# EAGLE design kirschmann-adsr (EAGLE 7.7.0)
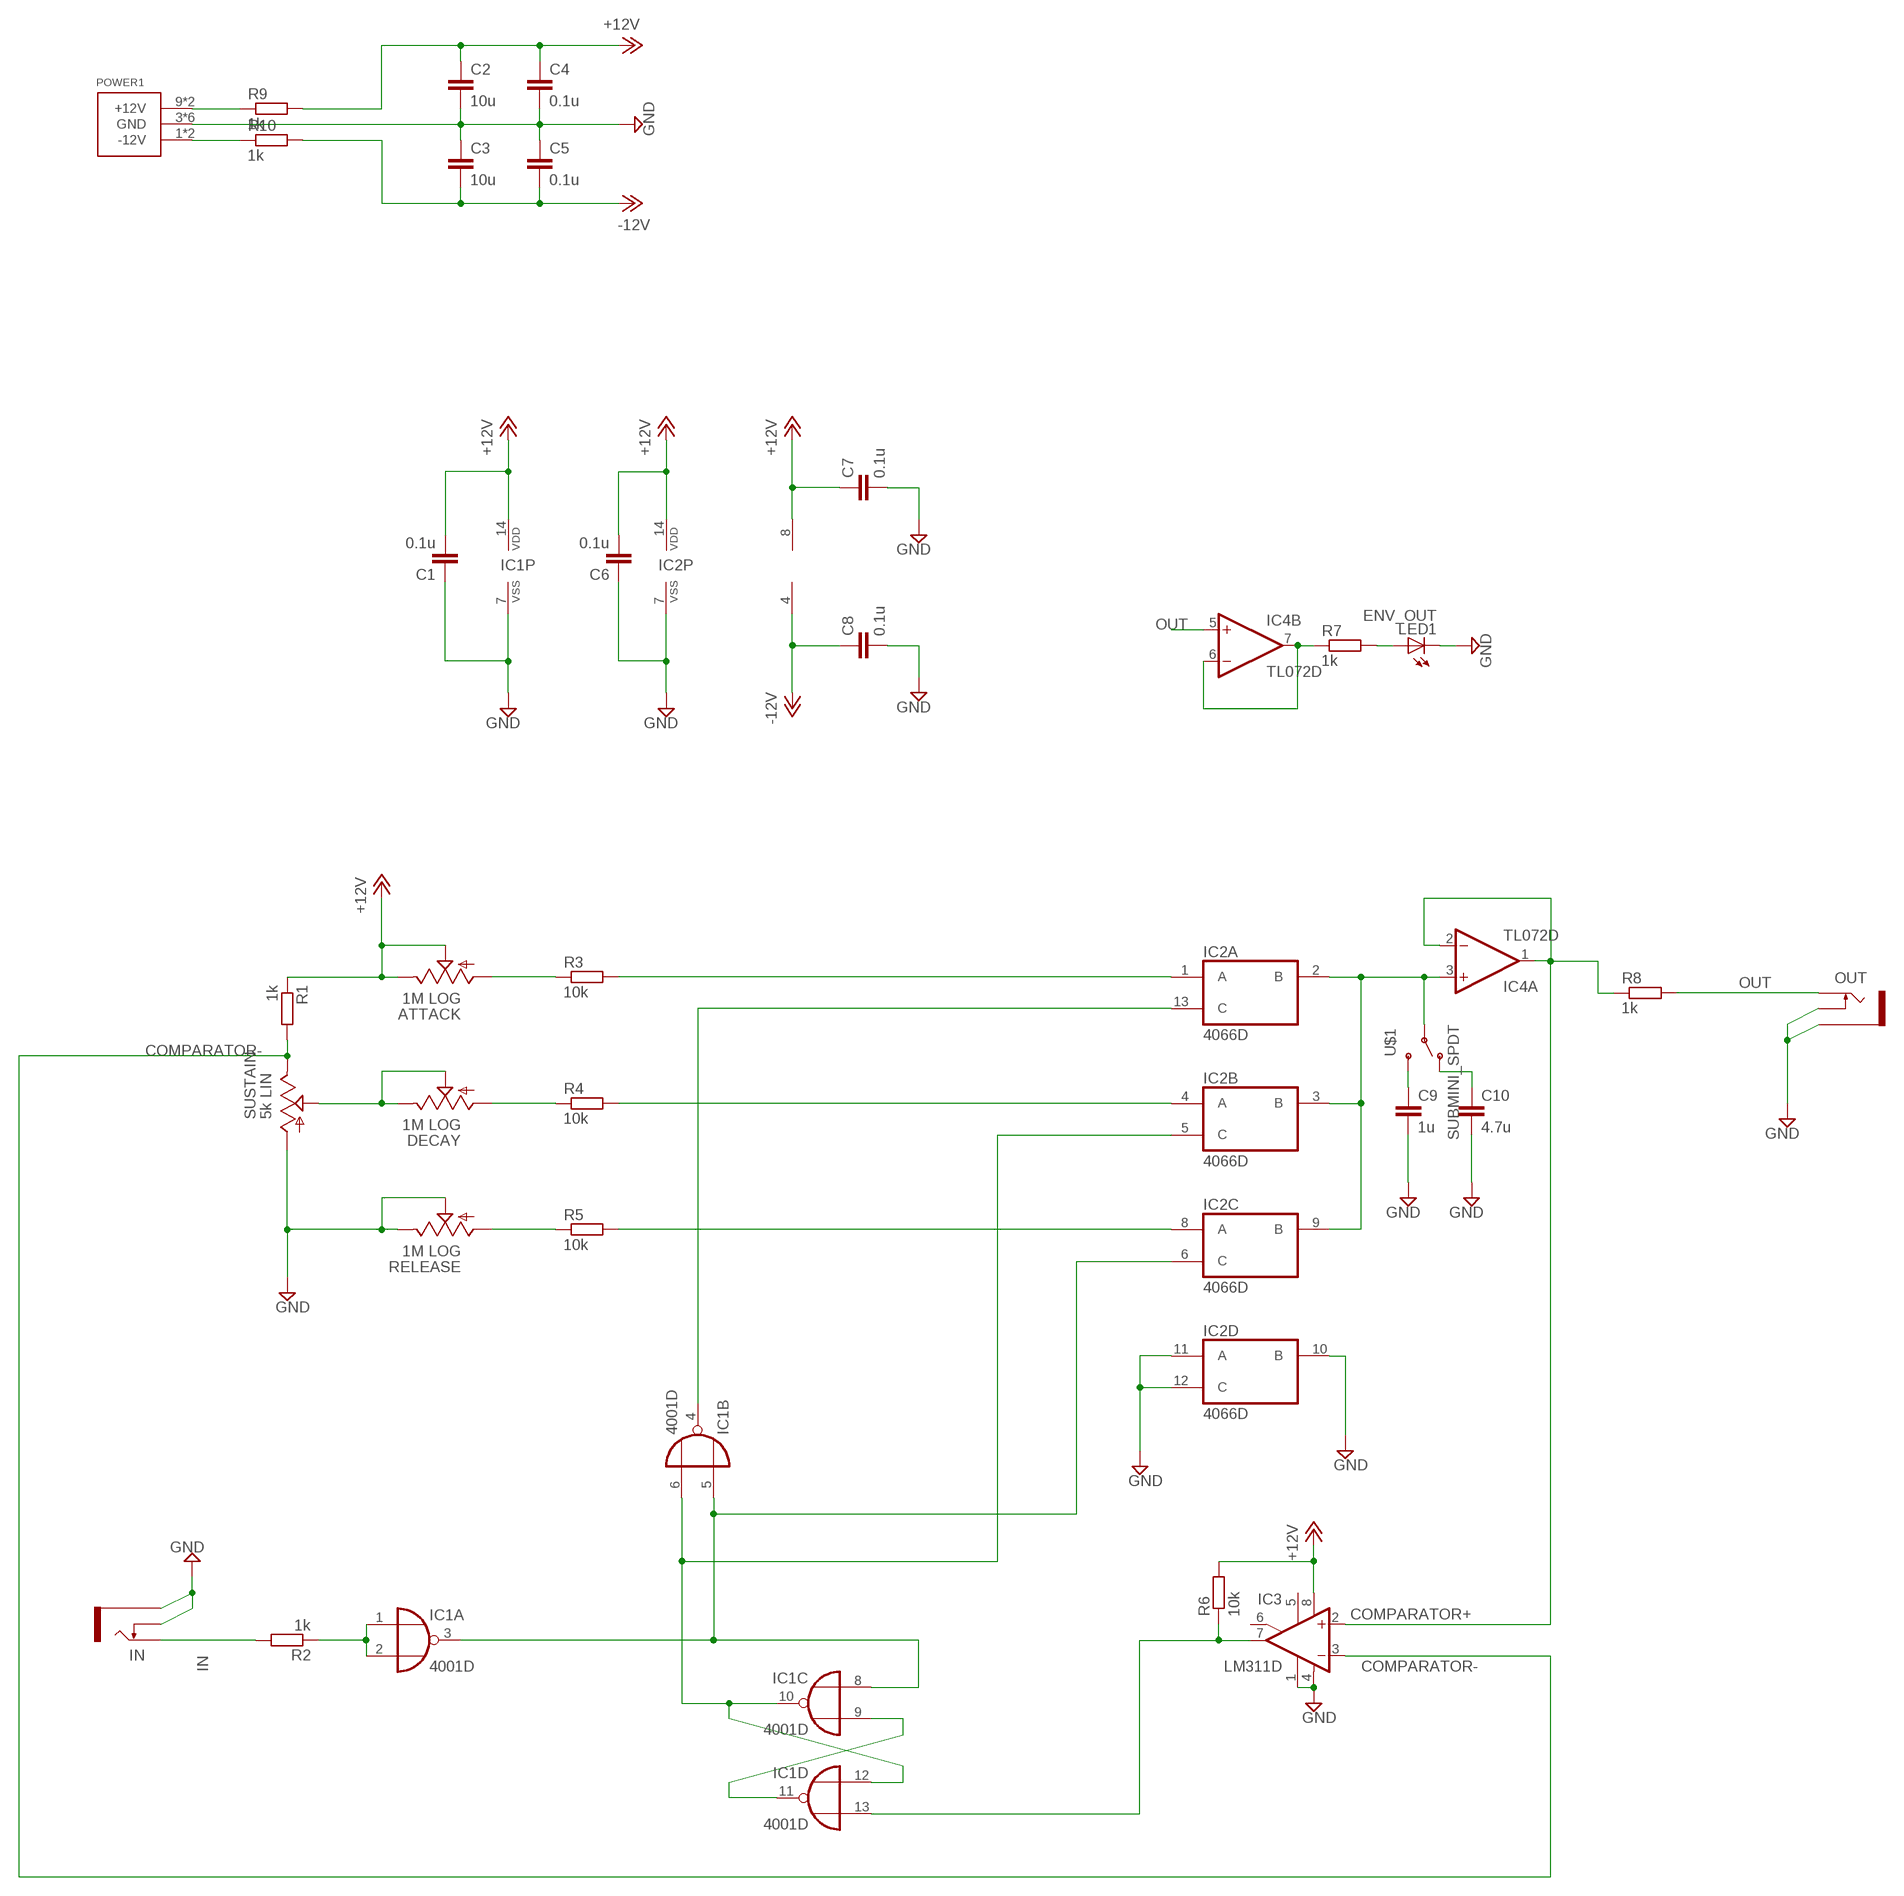
[diagram p0: schematic, sheet 1]

## Parts
ATTACK  1M LOG  9MM_SNAP-IN_POT_  [9MM_SNAP-IN_POT]
C1  0.1u  C-EUC0805  [C0805]
C2  10u  C-EUC0805  [C0805]
C3  10u  C-EUC0805  [C0805]
C4  0.1u  C-EUC0805  [C0805]
C5  0.1u  C-EUC0805  [C0805]
C6  0.1u  C-EUC0805  [C0805]
C7  0.1u  C-EUC0805  [C0805]
C8  0.1u  C-EUC0805  [C0805]
C9  1u  C-EUC0805  [C0805]
C10  4.7u  C-EUC0805  [C0805]
DECAY  1M LOG  9MM_SNAP-IN_POT_  [9MM_SNAP-IN_POT]
IC1  4001D  [SO14]
IC2  4066D  [SO14]
IC3  LM311D  [SO08]
IC4  TL072D  [SO08]
IN  THONKICONNNEW  [WQP-PJ301M-12_JACK]
LED1  ENV_OUT  LED3MM  [LED3MM]
OUT  THONKICONNNEW  [WQP-PJ301M-12_JACK]
POWER1  POWER_SIMPLE10  [POWER_10]
R1  1k  R-EU_R0805  [R0805]
R2  1k  R-EU_R0805  [R0805]
R3  10k  R-EU_R0805  [R0805]
R4  10k  R-EU_R0805  [R0805]
R5  10k  R-EU_R0805  [R0805]
R6  10k  R-EU_R0805  [R0805]
R7  1k  R-EU_R0805  [R0805]
R8  1k  R-EU_R0805  [R0805]
R9  1k  R-EU_R0805  [R0805]
R10  1k  R-EU_R0805  [R0805]
RELEASE  1M LOG  9MM_SNAP-IN_POT_  [9MM_SNAP-IN_POT]
SUSTAIN  5k LIN  9MM_SNAP-IN_POT_  [9MM_SNAP-IN_POT]
U$1  SUBMINI_SPDT  [SUBMINI_TOGGLE]

## Nets
+12V: ATTACK.2(S) ATTACK.3(E) C1.2 C2.1 C4.1 C6.2 C7.1 IC1.14(P:VDD) IC2.14(P:VDD) IC3.8(V+) IC4.8(P:V+) R1.1 R6.2 R9.2
-12V: C3.2 C5.2 C8.1 IC4.4(P:V-) R10.2
COMPARATOR+: IC3.2(+IN) IC4.1(A:OUT) IC4.2(A:-IN) R8.1
COMPARATOR-: IC3.3(-IN) R1.2 SUSTAIN.3(E)
GND: C1.1 C2.2 C3.1 C4.2 C5.1 C6.1 C7.2 C8.2 C9.2 C10.2 IC1.7(P:VSS) IC2.7(P:VSS) IC2.10(D:B) IC2.11(D:A) IC2.12(D:C) IC3.1(GND) IC3.4(V-) IN.P$2_SWITCH(SWITCH) IN.P$3_SLEEVE(SLEEVE) LED1.K(C) OUT.P$2_SWITCH(SWITCH) OUT.P$3_SLEEVE(SLEEVE) POWER1.3(GND) POWER1.4(GND) POWER1.5(GND) POWER1.6(GND) POWER1.7(GND) POWER1.8(GND) RELEASE.2(S) RELEASE.3(E) SUSTAIN.1(A)
IN: IN.P$1_TIP(TIP) R2.2
N$1: IC1.6(B:I1) IC1.10(C:O) IC1.12(D:I0) IC2.5(B:C)
N$2: IC1.9(C:I1) IC1.11(D:O)
N$3: IC2.8(C:A) R5.2
N$4: C9.1 U$1.3(S)
N$5: IC1.13(D:I1) IC3.7(OUT) R6.1
N$6: DECAY.1(A) R4.1
N$7: R5.1 RELEASE.1(A)
N$8: IC1.3(A:O) IC1.5(B:I0) IC1.8(C:I0) IC2.6(C:C)
N$9: IC1.4(B:O) IC2.13(A:C)
N$10: IC2.2(A:B) IC2.3(B:B) IC2.9(C:B) IC4.3(A:+IN) U$1.COM(COMMON)
N$11: C10.1 U$1.1(O)
N$12: IC1.1(A:I0) IC1.2(A:I1) R2.1
N$13: IC2.4(B:A) R4.2
N$14: IC2.1(A:A) R3.2
N$15: IC4.6(B:-IN) IC4.7(B:OUT) R7.1
N$16: LED1.A R7.2
N$17: DECAY.2(S) DECAY.3(E) SUSTAIN.2(S)
N$18: POWER1.9(+12V) POWER1.10(+12V) R9.1
N$19: ATTACK.1(A) R3.1
N$20: POWER1.1(-12V) POWER1.2(-12V) R10.1
OUT: IC4.5(B:+IN) OUT.P$1_TIP(TIP) R8.2
Unconnected: IC3.5(ON) IC3.6(ON/STR)

## Library data of the parts
ATTACK DECAY RELEASE SUSTAIN = MusicThingModular:9MM_SNAP-IN_POT: 9mm vertical snap-in pot, Alpha / Panasonic style
C1-C10 = rcl:C-EU: CAPACITOR, European symbol
IC1 = 40xx:4001: Quad 2-input NOR
IC2 = 40xx:4066: Quad bilateral ANALOG SWITCH
IC3 = linear:LM311: COMPARATOR
IC4 = linear:TL072: OP AMP
IN OUT = MusicThingModular:THONKICONN: 3.5mm socket for Eurorack modular synths
LED1 = led:LED: LED OSRAM: - CHIPLED LG R971, LG N971, LY N971, LG Q971, LY Q971, LO R971, LY R971 LH N974, LH R974 LS Q976, LO Q976, LY Q976 LO Q996 - Hyper CHIPLED LW Q18S LB Q993, LB Q99A, LB R99A - SideLED LS A670, LO A670, LY A670, LG A670, LP A670 LB A673, LV A673, LT A673, LW A673 LH A674 LY A675 LS A676, LA A676, LO A676, LY A676, LW A676 LS A679, LY A679, LG A679 - Hyper Micro SIDELED® LS Y876, LA Y876, LO Y876, LY Y876 LT Y87S - SmartLED LW L88C, LW L88S LB L89C, LB L89S, LG L890 LS L89K, LO L89K, LY L89K LS L896, LA L896, LO L896, LY L896 - TOPLED LS T670, LO T670, LY T670, LG T670, LP T670 LSG T670, LSP T670, LSY T670, LOP T670, LYG T670 LG T671, LOG T671, LSG T671 LB T673, LV T673, LT T673, LW T673 LH T674 LS T676, LA T676, LO T676, LY T676, LB T676, LH T676, LSB T676, LW T676 LB T67C, LV T67C, LT T67C, LS T67K, LO T67K, LY T67K, LW E67C LS E67B, LA E67B, LO E67B, LY E67B, LB E67C, LV E67C, LT E67C LW T67C LS T679, LY T679, LG T679 LS T770, LO T770, LY T770, LG T770, LP T770 LB T773, LV T773, LT T773, LW T773 LH T774 LS E675, LA E675, LY E675, LS T675 LS T776, LA T776, LO T776, LY T776, LB T776 LHGB T686 LT T68C, LB T68C - Hyper Mini TOPLED® LB M676 - Mini TOPLED Santana® LG M470 LS M47K, LO M47K, LY M47K Source: http://www.osram.convergy.de LUXEON: - LUMILED® LXK2-PW12-R00, LXK2-PW12-S00, LXK2-PW14-U00, LXK2-PW14-V00 LXK2-PM12-R00, LXK2-PM12-S00, LXK2-PM14-U00 LXK2-PE12-Q00, LXK2-PE12-R00, LXK2-PE12-S00, LXK2-PE14-T00, LXK2-PE14-U00 LXK2-PB12-K00, LXK2-PB12-L00, LXK2-PB12-M00, LXK2-PB14-N00, LXK2-PB14-P00, LXK2-PB14-Q00 LXK2-PR12-L00, LXK2-PR12-M00, LXK2-PR14-Q00, LXK2-PR14-R00 LXK2-PD12-Q00, LXK2-PD12-R00, LXK2-PD12-S00 LXK2-PH12-R00, LXK2-PH12-S00 LXK2-PL12-P00, LXK2-PL12-Q00, LXK2-PL12-R00 Source: www.luxeon.com KINGBRIGHT: KA-3528ASYC Source: www.kingbright.com
POWER1 = eurorack:POWER_SIMPLE
R1-R10 = rcl:R-EU_: RESISTOR, European symbol
U$1 = MusicThingModular:SUBMINI_SPDT

## Board
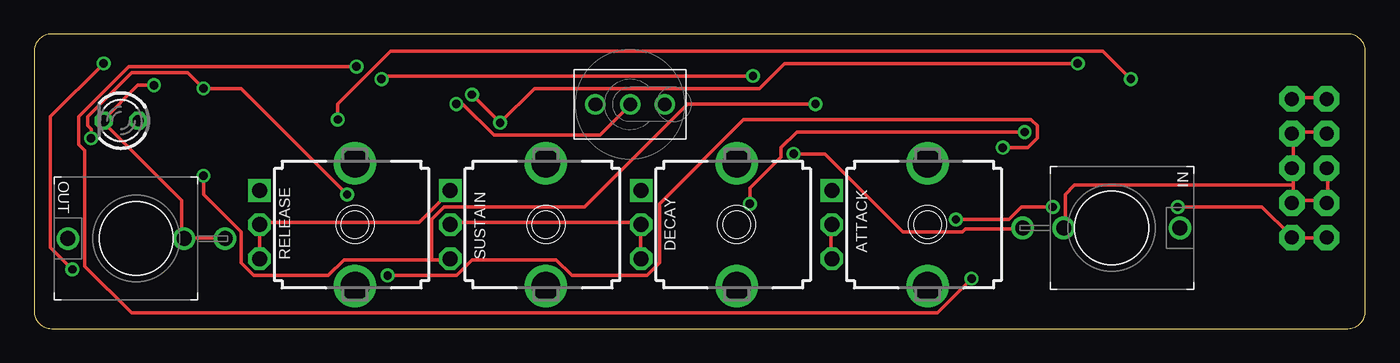
[diagram p1: board, top side]
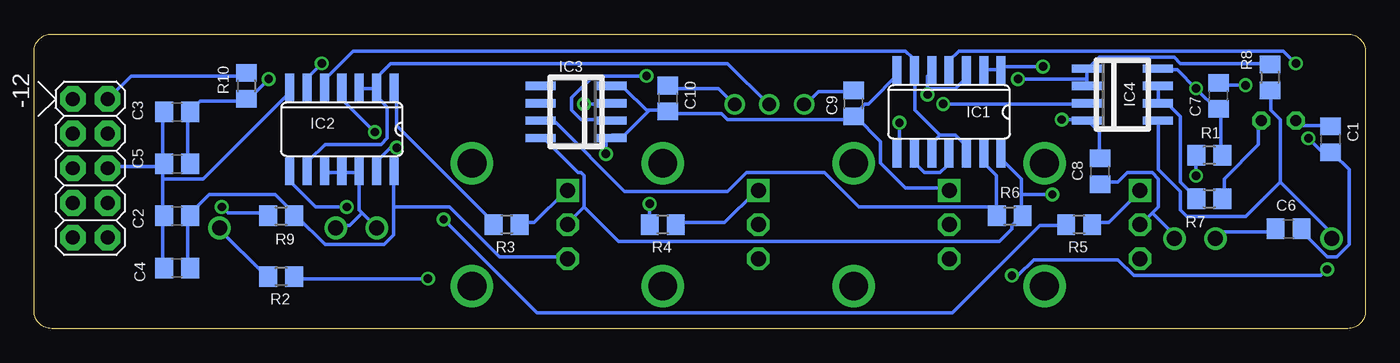
[diagram p2: board, bottom side, seen from below]

Size 97.46 x 21.58 mm. Coordinates in mm from the lower left corner, seen from the top.
Outline: 0,20.31 0,1.27 arc90 1.27,0 96.19,0 arc90 97.46,1.27 97.46,20.31 arc90 96.19,21.58 1.27,21.58 arc90 0,20.31
Copper layers (1*16): Top 0.035mm / dielectric 1.5mm / Bottom 0.035mm
Design rules "default": minimum track width 10mil, minimum drill 24mil, track to track 8mil, track to pad 8mil, pad to pad 8mil, via to via 8mil, smd to smd 8mil, copper to edge 40mil, drill to drill 8mil, minimum pad ring 10mil, minimum via ring 8mil, stop-mask expansion 4mil, vias tented up to drill 0mil, thermal gap 10mil

### Footprints (pad centres in the part's own frame; a part is rotated, then mirrored left to right if it is on the bottom)
9MM_SNAP-IN_POT = drill 1.1 square: 1 -2.5,-7 | drill 1.1 octagon: 2 0,-7; 3 2.5,-7 | drill 2.1 pad 2.794: CHASSIS1 -4.5,0; CHASSIS2 4.5,0
C0805 = smd 1.3 x 1.5: 1 -0.95,0; 2 0.95,0
SO14 = smd 0.66 x 2.032: 1 -3.81,-3.073; 2 -2.54,-3.073; 3 -1.27,-3.073; 4 0,-3.073; 5 1.27,-3.073; 6 2.54,-3.073; 7 3.81,-3.073; 8 3.81,3.073; 9 2.54,3.073; 10 1.27,3.073; 11 0,3.073; 12 -1.27,3.073; 13 -2.54,3.073; 14 -3.81,3.073
SO08 = smd 0.6 x 2.2: 1 -1.905,-2.6; 2 -0.635,-2.6; 3 0.635,-2.6; 4 1.905,-2.6; 5 1.905,2.6; 6 0.635,2.6; 7 -0.635,2.6; 8 -1.905,2.6
WQP-PJ301M-12_JACK = drill 1.1: P$1_TIP 0,5; P$2_SWITCH 0,-3.5; P$3_SLEEVE 0,-6.5
LED3MM = drill 0.813 octagon: A -1.27,0; K 1.27,0
POWER_10 = drill 1.016 pad 1.88 octagon: 1 -5.08,-1.27; 2 -5.08,1.27; 3 -2.54,-1.27; 4 -2.54,1.27; 5 0,-1.27; 6 0,1.27; 7 2.54,-1.27; 8 2.54,1.27; 9 5.08,-1.27; 10 5.08,1.27
R0805 = smd 1.3 x 1.5: 1 -0.95,0; 2 0.95,0
SUBMINI_TOGGLE = drill 1 pad 1.422: 1 -2.54,0; 3 2.54,0; COM 0,0

### Placement (x,y rotation side)
ATTACK  65.41,7.62 270 top
C1  2.55,13.87 270 bottom
C2  86.99,8.26 180 bottom
C3  86.99,15.88 0 bottom
C4  86.99,4.45 180 bottom
C5  86.99,12.06 0 bottom
C6  5.62,7.31 0 bottom
C7  10.76,17.05 90 bottom
C8  19.42,11.53 270 bottom
C9  37.47,16.51 270 bottom
C10  51.06,16.86 270 bottom
DECAY  51.44,7.62 270 top
IC1  30.48,15.88 180 bottom
IC2  74.93,14.61 180 bottom
IC3  57.79,15.88 90 bottom
IC4  17.78,17.14 270 bottom
IN  78.88,7.38 270 top
LED1  6.35,15.24 180 top
OUT  7.47,6.61 90 top
POWER1  93.35,11.75 270 bottom
R1  11.43,12.7 180 bottom
R2  79.38,3.81 180 bottom
R3  62.87,7.62 180 bottom
R4  51.44,7.62 180 bottom
R5  20.95,7.62 180 bottom
R6  26.04,8.26 0 bottom
R7  11.43,9.53 0 bottom
R8  6.99,18.41 270 bottom
R9  79.38,8.26 0 bottom
R10  81.91,17.78 270 bottom
RELEASE  23.49,7.62 270 top
SUSTAIN  37.47,7.62 270 top
U$1  43.64,16.43 180 top

### Tracks (layer width: path | path; a pad name or v marks a point on that pad's centre or on a via)
+12V  (via drill 0.61)
  Top 0.254: v4.17,13.95 4.17,14.63 3.94,14.86 3.94,15.54 7.14,18.75 11.25,18.75 v12.39,17.6 15.14,17.6 v22.91,9.83 | ATTACK.3 58.34,5.26 58.34,7.54 ATTACK.2
  Bottom 0.254: C6.2 4.62,7.09 2.79,5.26 2.11,5.26 1.19,6.17 1.19,11.66 2.34,12.8 C1.2 2.57,13.03 3.25,13.03 v4.17,13.95 | R1.1 10.57,12.8 10.57,16 C7.1 10.79,16 v12.39,17.6 13.77,18.97 15.14,18.97 IC4.8 | C4.1 86.23,4.57 86.23,8.23 C2.1 86,8.46 84.63,9.83 79.83,9.83 78.46,8.46 R9.2 78.23,8.23 76.17,6.17 71.83,6.17 71.14,6.86 71.14,8.91 | 71.14,8.91 71.14,11.43 IC2.14 | 25.2,9.83 25.2,10.97 26.57,12.34 26.57,12.8 IC1.14 | 25.2,9.83 25.2,8.46 R6.2 25.2,8.23 25.88,7.54 25.88,7.32 26.8,6.4 54.69,6.4 57.2,8.91 | 57.2,8.91 57.2,11.2 57.43,11.43 57.66,11.43 60.17,13.95 IC3.8 | 57.2,8.91 58.34,7.77 ATTACK.2 | 71.14,8.91 67.03,8.91 63.37,5.26 58.57,5.26 ATTACK.3 | 25.2,9.83 v22.91,9.83
-12V  (via drill 0.61)
  Top 0.254: v22.22,15.32 22.22,16.46 26.11,20.34 78.23,20.34 v80.29,18.29
  Bottom 0.254: C8.1 19.48,12.57 19.48,14.4 20.17,15.09 IC4.4 20.4,15.32 v22.22,15.32 | C5.2 86.23,12.12 86.23,15.77 C3.2 86,16 85.32,16.69 82.12,16.69 R10.2 81.89,16.69 v80.29,18.29
COMPARATOR+  (via drill 0.61)
  Top 0.254: v52.63,18.52 25.65,18.52 v25.42,18.29
  Bottom 0.254: R8.1 7.14,19.43 13.54,19.43 14,19.89 19.48,19.89 20.17,19.2 IC4.1 20.4,18.97 20.4,18.29 | 20.4,18.29 20.4,17.83 IC4.2 | v52.63,18.52 56.52,18.52 58.12,16.92 58.12,16 57.43,15.32 55.37,15.32 IC3.2 | 20.4,18.29 v25.42,18.29
COMPARATOR-  (via drill 0.61)
  Top 0.254: v12.39,11.2 12.39,9.83 15.14,7.09 15.14,4.8 16.05,3.89 21.54,3.89 22.68,5.03 29.08,5.03 | 29.08,5.03 30.45,5.03 SUSTAIN.3 | v57.2,16.46 47.83,16.46 40.28,8.91 30,8.91 29.08,8 29.08,5.03
  Bottom 0.254: v12.39,11.2 12.39,12.57 R1.2 | v57.2,16.46 55.37,16.46 IC3.3
GND  (via drill 0.61)
  Top 0.254: POWER1.3 94.46,14.4 92.18,14.4 POWER1.4 92.18,14.17 92.18,11.89 POWER1.6 92.18,11.66 92.18,10.52 | 92.18,10.52 92.18,9.37 | POWER1.5 94.69,11.66 94.69,9.37 POWER1.7 94.46,9.37 92.18,9.37 | 92.18,9.37 POWER1.8 | 92.18,10.52 76.17,10.52 75.49,9.83 75.49,7.54 IN.P$2_SWITCH | v8.77,17.83 7.6,17.83 5.08,15.32 LED1.K 5.08,15.09 10.79,9.37 10.79,6.63 OUT.P$2_SWITCH 11.02,6.63 13.77,6.63 OUT.P$3_SLEEVE | RELEASE.3 16.51,5.26 16.51,7.54 RELEASE.2 16.51,7.77 28.17,7.77 30.45,10.06 SUSTAIN.1 | v55.6,12.8 57.89,12.8 63.6,7.09 67.94,7.09 68.17,7.32 72.29,7.32 IN.P$3_SLEEVE
  Bottom 0.254: C4.2 88.06,4.57 88.06,8.23 C2.2 88.06,8.46 88.06,10.97 | 88.06,10.97 88.06,11.89 | C3.1 88.06,15.77 88.06,12.12 C5.1 88.06,11.89 | 88.06,10.97 85.09,10.97 78.92,17.14 78.92,17.6 IC2.7 | 73.66,11.43 74.8,11.43 IC2.11 75.03,11.43 76.17,11.43 IC2.10 | 73.66,11.43 73.66,8.69 73.43,8.46 | 73.43,8.46 72.52,7.54 IN.P$3_SLEEVE | 73.66,11.43 IC2.12 | 73.43,8.46 74.35,7.54 75.26,7.54 IN.P$2_SWITCH | 88.06,11.89 91.95,11.89 POWER1.6 | C1.1 2.57,14.86 4.85,14.86 5.08,15.09 LED1.K | v8.77,17.83 10.57,17.83 C7.2 | 15.6,8.46 16.28,7.77 RELEASE.2 | 15.6,8.46 15.14,8.91 15.14,10.97 15.6,11.43 17.42,11.43 18.11,10.74 19.25,10.74 C8.2 | C6.1 6.68,7.09 10.34,7.09 10.79,6.63 OUT.P$2_SWITCH | 15.6,8.46 13.77,6.63 OUT.P$3_SLEEVE | 52.4,16 52.63,16 54.23,17.6 55.14,17.6 IC3.4 | 52.4,16 51.26,16 C10.2 51.03,15.77 47.14,15.77 46.69,15.32 37.77,15.32 37.54,15.54 C9.2 | 52.4,16 54.23,14.17 55.14,14.17 IC3.1 55.37,13.95 55.6,13.72 v55.6,12.8 | C9.2 37.31,15.77 36.63,16.46 36.4,16.46 34.11,18.75 IC1.7 | SUSTAIN.1 30.68,10.29 33.66,10.29 35.48,12.12 35.48,13.72 37.31,15.54 C9.2
IN
  Bottom 0.254: R2.2 80.52,3.89 83.95,7.32 IN.P$1_TIP
N$1
  Bottom 0.254: 31.14,14.17 30,14.17 29.31,13.49 29.31,12.8 IC1.12 | 31.14,14.17 31.6,13.72 31.6,12.8 IC1.10 | 31.14,14.17 32.97,16 32.97,18.75 IC1.6 33.2,18.97 33.2,19.89 33.66,20.34 74.12,20.34 76.17,18.29 76.17,17.83 IC2.5
N$2
  Bottom 0.254: IC1.11 30.68,12.8 30.68,11.89 31.14,11.43 32.28,11.43 32.97,12.12 32.97,12.8 IC1.9
N$3  (via drill 0.61)
  Top 0.254: v67.49,8 71.37,8 72.29,8.91 v74.57,8.91
  Bottom 0.254: v67.49,8 60.63,1.14 30.23,1.14 23.82,7.54 22,7.54 R5.2 | v74.57,8.91 76.86,8.91 78.69,10.74 78.69,11.43 IC2.8
N$4
  Bottom 0.254: C9.1 37.54,17.37 40.06,17.37 40.97,16.46 U$1.3
N$5
  Bottom 0.254: 27.03,8.91 27.03,11.2 27.94,12.12 IC1.13 | 27.03,8.91 27.03,8.46 R6.1 27.03,8.91 | 27.03,8.91 37.08,8.91 39.6,11.43 45.31,11.43 46.69,10.06 54.23,10.06 59.26,15.09 60.17,15.09 IC3.7
N$6
  Bottom 0.254: R4.1 50.34,7.77 46.91,7.77 44.63,10.06 DECAY.1
N$7
  Bottom 0.254: R5.1 19.94,7.77 18.8,7.77 16.51,10.06 RELEASE.1
N$8  (via drill 0.61)
  Top 0.254: v32.05,17.14 v34.11,15.09 36.63,17.6 53.09,17.6 54.91,19.43 v76.4,19.43
  Bottom 0.254: v34.11,15.09 34.11,12.8 IC1.8 | 32.05,17.6 32.05,18.52 31.83,18.75 IC1.5 | 32.05,17.6 30,17.6 29.31,18.29 29.31,18.75 IC1.3 | 32.05,17.6 v32.05,17.14 | v76.4,19.43 77.32,18.52 77.32,17.83 IC2.6
N$9  (via drill 0.61)
  Top 0.254: v70.92,13.26 72.75,13.26 73.43,13.95 73.43,14.86 72.97,15.32 51.94,15.32 45.77,9.14 45.77,4.8 44.86,3.89 39.37,3.89 38.23,5.03 32.05,5.03 30.91,3.89 v25.88,3.89 | v2.79,4.34 1.19,5.94 1.19,15.54 v5.08,19.43
  Bottom 0.254: v70.92,13.26 71.37,13.26 72.29,12.34 72.29,11.66 IC2.13 | v25.88,3.89 25.42,3.89 24.28,5.03 18.11,5.03 16.97,3.89 3.25,3.89 v2.79,4.34 | v5.08,19.43 5.99,20.34 29.77,20.34 30.45,19.66 30.45,18.97 IC1.4
N$10  (via drill 0.61)
  Top 0.254: v30.91,16.46 31.37,16.46 33.66,14.17 41.43,14.17 43.48,16.23 U$1.COM
  Bottom 0.254: IC2.2 72.52,17.6 73.66,17.6 IC2.3 | IC2.9 77.32,11.66 77.32,12.34 76.17,13.49 72.06,13.49 71.6,13.95 71.6,16.23 72.29,16.92 72.29,17.6 IC2.2 | v30.91,16.46 20.4,16.46 IC4.3 | IC2.2 72.29,17.83 72.29,18.52 71.37,19.43 46.69,19.43 43.71,16.46 U$1.COM
N$11
  Bottom 0.254: C10.1 51.03,17.6 47.37,17.6 46.23,16.46 U$1.1
N$12  (via drill 0.61)
  Top 0.254: v68.63,3.66 66.12,1.14 7.14,1.14 3.71,4.57 3.71,13.03 3.25,13.49 3.25,15.54 6.91,19.2 v23.6,19.2
  Bottom 0.254: v68.63,3.66 78.23,3.66 R2.1 | v23.6,19.2 26.34,19.2 26.57,18.97 IC1.1 26.8,18.97 27.94,18.97 IC1.2
N$13  (via drill 0.61)
  Top 0.254: v52.4,9.14 52.4,10.29 54.69,12.57 54.69,13.26 55.83,14.4 v72.52,14.4
  Bottom 0.254: v52.4,9.14 52.4,7.77 R4.2 | v72.52,14.4 74.8,16.69 74.8,17.6 IC2.4
N$14
  Bottom 0.254: R3.2 63.83,7.77 70.92,14.86 70.92,17.6 IC2.1
N$15
  Bottom 0.254: R7.1 12.39,9.6 13.54,10.74 13.54,15.54 14.45,16.46 15.14,16.46 IC4.6 15.14,16.69 15.14,17.6 IC4.7
N$16
  Bottom 0.254: R7.2 10.34,9.6 10.34,10.97 7.82,13.49 7.82,15.09 LED1.A
N$17
  Top 0.254: DECAY.3 44.4,5.26 44.4,7.54 DECAY.2 44.4,7.77 30.68,7.77 SUSTAIN.2
N$18  (via drill 0.61)
  Top 0.254: v83.72,8.91 89.89,8.91 91.95,6.86 POWER1.10 92.18,6.63 94.46,6.63 POWER1.9
  Bottom 0.254: v83.72,8.91 83.26,8.46 80.52,8.46 R9.1
N$19
  Bottom 0.254: R3.1 61.77,7.77 60.86,7.77 58.57,10.06 ATTACK.1
N$20
  Top 0.254: POWER1.1 94.46,16.92 92.18,16.92 POWER1.2
  Bottom 0.254: R10.1 82.12,18.52 90.35,18.52 91.95,16.92 POWER1.2
OUT
  Bottom 0.254: 6.22,10.74 6.22,15.32 6.91,16 6.91,17.37 R8.2 | 6.22,10.74 2.57,7.09 2.57,6.63 OUT.P$1_TIP | 6.22,10.74 8.74,8.23 13.08,8.23 13.54,8.69 13.54,10.06 15.14,11.66 15.14,15.09 IC4.5